# EAGLE design tinytemp3v3-v01 (EAGLE 5.10)
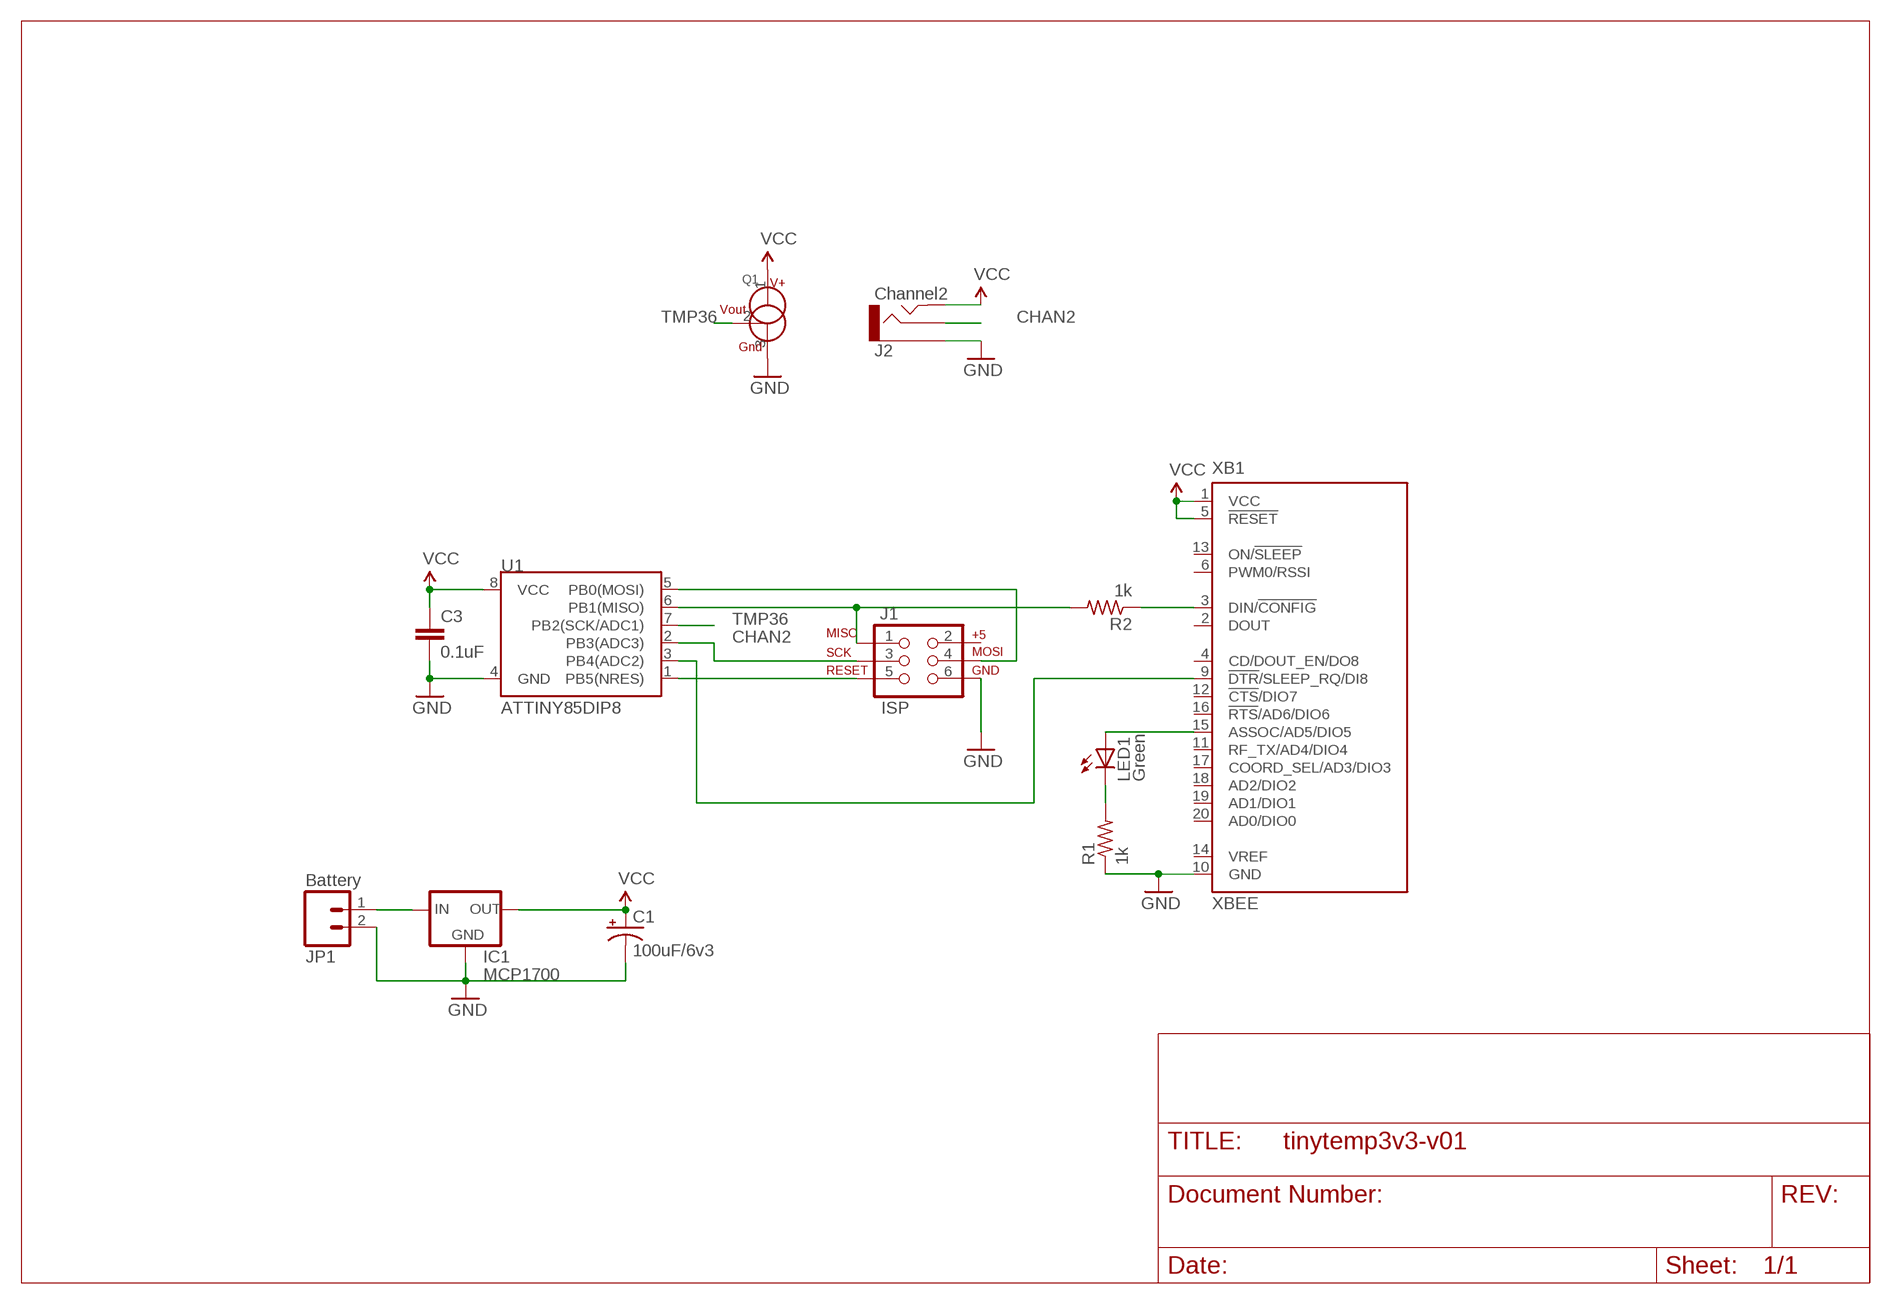
[diagram p0: schematic, sheet 1]

## Parts
C1  100uF/6v3  CPOL-USE2.5-6  [E2,5-6]
C3  0.1uF  C-EU050-024X044  [C050-024X044]
IC1  MCP1700  MCP1700INLINE  [TO92-INLINE]
J1  ISP  AVR_SPI_PRG_62X3_LOCK  [2X3_LOCK]
J2  Channel2  AUDIO-JACK2.5MM  [STEREOJACK2.5MM_STEREOJACK2.5MM]
JP1  Battery  M025MM  [SCREWTERMINAL-5MM-2]
LED1  Green  LED3MM  [LED3MM]
Q1  TMP36  TMP35,TMP36,TMP37  [TO92-INLINE]
R1  1k  R-US_0207/7  [0207/7]
R2  1k  R-US_0207/7  [0207/7]
U1  ATTINY85DIP8  ATTINY45DIP8  [DIP08]
XB1  XBEE  [XBEE]

## Nets
CHAN2: J1.3 J2.TIP U1.2(PB3(ADC3))
GND: C1.- C3.2 IC1.1(GND) J1.6 J2.RING1 JP1.2 Q1.3(GND) R1.1 U1.4(GND) XB1.10(GND)
N$1: IC1.2(IN) JP1.1
N$2: J1.5 U1.1(PB5(NRES))
N$3: J1.4 U1.5(PB0(MOSI))
N$4: J1.1 R2.2 U1.6(PB1(MISO))
N$5: R2.1 XB1.3(DIN/!CONFIG)
N$6: U1.3(PB4(ADC2)) XB1.9(!DTR!/SLEEP_RQ/DI8)
N$7: LED1.A XB1.15(ASSOC/AD5/DIO5)
N$8: LED1.K(C) R1.2
TMP36: Q1.2(VOUT) U1.7(PB2(SCK/ADC1))
VCC: C1.+ C3.1 IC1.3(OUT) J2.SHIELD Q1.1(V+) U1.8(VCC) XB1.1(VCC) XB1.5(!RESET)
Unconnected: J1.2 XB1.2(DOUT) XB1.4(CD/DOUT_EN/DO8) XB1.6(PWM0/RSSI) XB1.11(RF_TX/AD4/DIO4) XB1.12(!CTS!/DIO7) XB1.13(ON/!SLEEP) XB1.14(VREF) XB1.16(!RTS!/AD6/DIO6) XB1.17(COORD_SEL/AD3/DIO3) XB1.18(AD2/DIO2) XB1.19(AD1/DIO1) XB1.20(AD0/DIO0)

## Library data of the parts
C1 = resistor:CPOL-US: POLARIZED CAPACITOR, American symbol
C3 = resistor:C-EU: CAPACITOR, European symbol
IC1 = adafruit:MCP1700: VOLTAGE REGULATOR
J1 = karlnet-parts:AVR_SPI_PRG_6: AVR ISP 6 Pin This is the reduced ISP connector for AVR programming. Common on Arduino. This footprint will take up less PCB space and can be used with a 10-pin to 6-pin adapter such as SKU: BOB-08508
J2 = SparkFun:AUDIO-JACK: 3.5mm Audio Jack Simple 3.5mm common PCB mount audio jack. SKU: PRT-08032
JP1 = SparkFun:M02: Header 2 Standard 2-pin 0.1" header. Use with straight break away headers (SKU : PRT-00116), right angle break away headers (PRT-00553), swiss pins (PRT-00743), machine pins (PRT-00117), and female headers (PRT-00115). Molex polarized connector foot print use with SKU : PRT-08233 with associated crimp pins and housings.
LED1 = adafruit:LED: LED OSRAM: - CHIPLED LG R971, LG N971, LY N971, LG Q971, LY Q971, LO R971, LY R971 LH N974, LH R974 LS Q976, LO Q976, LY Q976 LO Q996 - Hyper CHIPLED LW Q18S LB Q993, LB Q99A, LB R99A - SideLED LS A670, LO A670, LY A670, LG A670, LP A670 LB A673, LV A673, LT A673, LW A673 LH A674 LY A675 LS A676, LA A676, LO A676, LY A676, LW A676 LS A679, LY A679, LG A679 - Hyper Micro SIDELED® LS Y876, LA Y876, LO Y876, LY Y876 LT Y87S - SmartLED LW L88C, LW L88S LB L89C, LB L89S, LG L890 LS L89K, LO L89K, LY L89K LS L896, LA L896, LO L896, LY L896 - TOPLED LS T670, LO T670, LY T670, LG T670, LP T670 LSG T670, LSP T670, LSY T670, LOP T670, LYG T670 LG T671, LOG T671, LSG T671 LB T673, LV T673, LT T673, LW T673 LH T674 LS T676, LA T676, LO T676, LY T676, LB T676, LH T676, LSB T676, LW T676 LB T67C, LV T67C, LT T67C, LS T67K, LO T67K, LY T67K, LW E67C LS E67B, LA E67B, LO E67B, LY E67B, LB E67C, LV E67C, LT E67C LW T67C LS T679, LY T679, LG T679 LS T770, LO T770, LY T770, LG T770, LP T770 LB T773, LV T773, LT T773, LW T773 LH T774 LS E675, LA E675, LY E675, LS T675 LS T776, LA T776, LO T776, LY T776, LB T776 LHGB T686 LT T68C, LB T68C - Hyper Mini TOPLED® LB M676 - Mini TOPLED Santana® LG M470 LS M47K, LO M47K, LY M47K Source: http://www.osram.convergy.de/
Q1 = karlnet-parts:TMP35,TMP36,TMP37: Analog Devices TMP35, TMP36 and TMP37 analog output temperature sensors, TO-92 packaging
R1 R2 = resistor:R-US_: RESISTOR, American symbol
U1 = SparkFun:ATTINY45: Atmel ATTiny45
XB1 = microbuilder:XBEE: XBee (TM) /XBee-PRO(TM) OEM RF Modules Source: MaxStream, Inc. xbee_productmanual.pdf

## Board
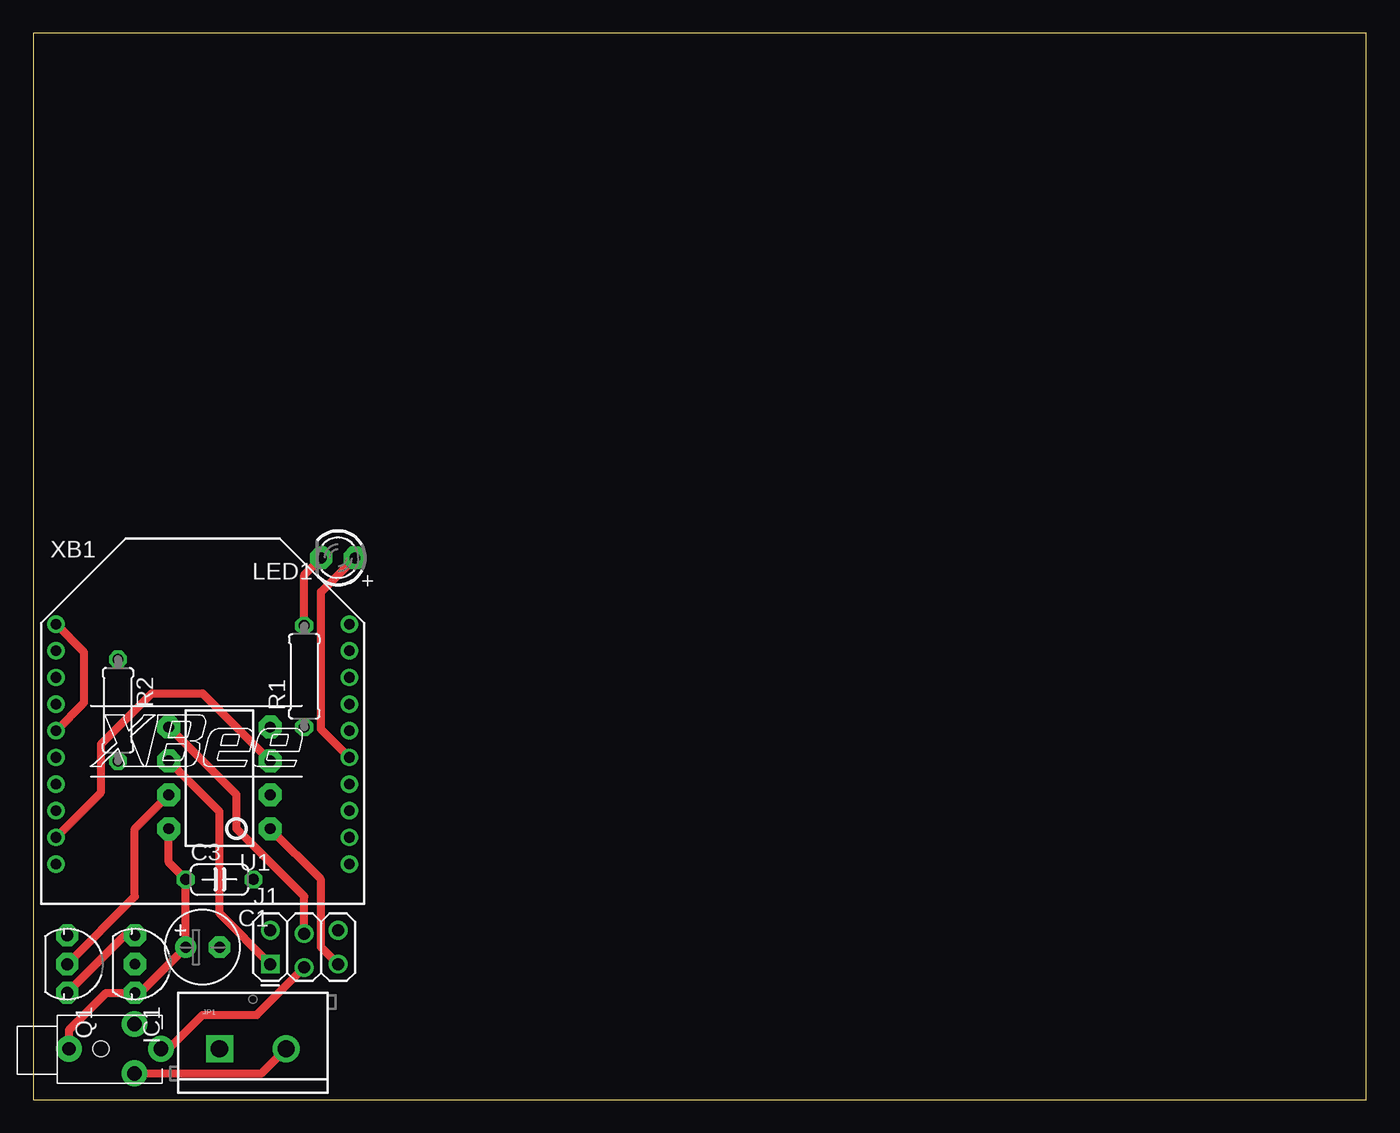
[diagram p1: board, top side]
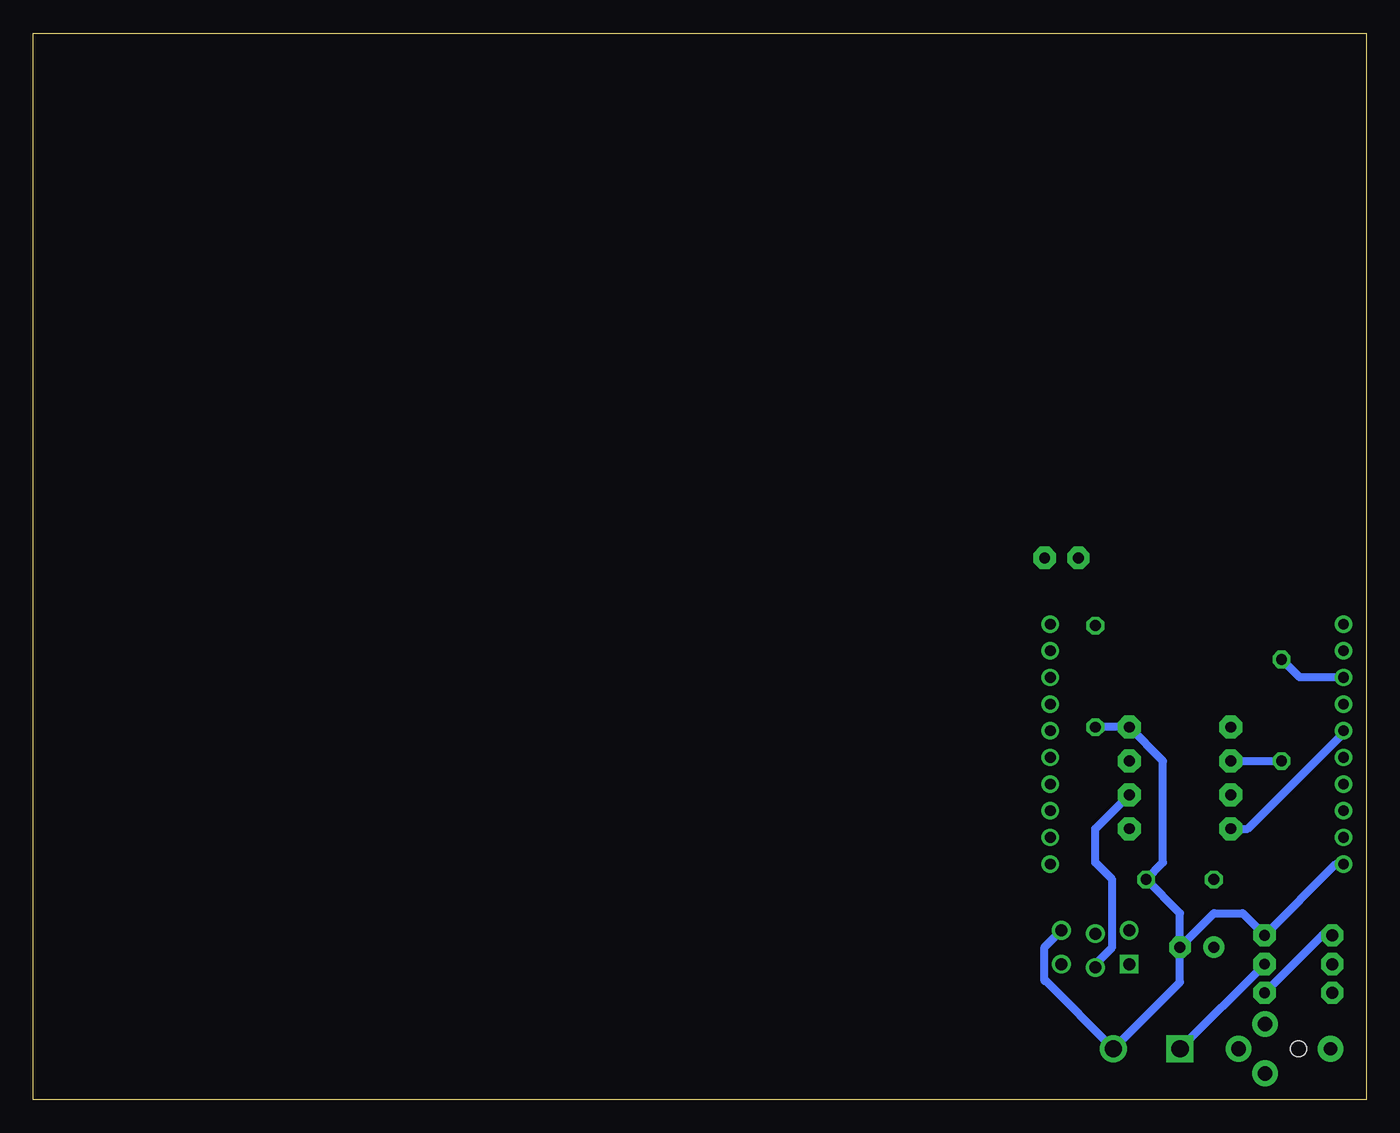
[diagram p2: board, bottom side, seen from below]

Size 100 x 80 mm. Coordinates in mm from the lower left corner, seen from the top.
Outline: 0,0 100,0 100,80 0,80 0,0
Copper layers (1*16): Top 0.035mm / dielectric 1.5mm / Bottom 0.035mm
Design rules "olimex-10mils": minimum track width 10mil, minimum drill 24mil, track to track 10mil, track to pad 10mil, pad to pad 10mil, via to via 10mil, smd to smd 10mil, copper to edge 40mil, drill to drill 10mil, minimum pad ring 10mil, minimum via ring 8mil, stop-mask expansion 0mil, vias tented up to drill 0mil, thermal gap 10mil

### Footprints (pad centres in the part's own frame; a part is rotated, then mirrored left to right if it is on the bottom)
E2,5-6 = drill 0.813 pad 1.6 round: + -1.27,0 | drill 0.813 pad 1.6 octagon: - 1.27,0
C050-024X044 = drill 0.813 octagon: 1 -2.54,0; 2 2.54,0
TO92-INLINE = drill 0.813 pad 1.676 octagon: 1 -2.159,0; 2 0,0; 3 2.159,0
2X3_LOCK = drill 0.9 square: 1 0,0 | drill 0.9 round: 2 0,2.54; 3 2.54,-0.254; 4 2.54,2.286; 5 5.08,0; 6 5.08,2.54
STEREOJACK2.5MM_STEREOJACK2.5MM = drill 1.1 pad 1.93 round: RING1 2.5,-1.85; RING2 2.5,1.85; TIP 4.5,0 | drill 1 pad 1.93 round: SHIELD -2.4,0 | hole 1.2: 0,0
SCREWTERMINAL-5MM-2 = drill 1.3 pad 2.032 square: 1 0,0 | drill 1.3 pad 2.032 round: 2 5,0
LED3MM = drill 0.813 pad 1.676 octagon: A -1.27,0; K 1.27,0
TO92-INLINE' = drill 0.9 pad 1.676 octagon: 1 -2.159,0; 2 0,0; 3 2.159,0
0207/7 = drill 0.813 octagon: 1 -3.81,0; 2 3.81,0
DIP08 = drill 0.813 pad 1.727 octagon: 1 -3.81,-3.81; 2 -1.27,-3.81; 3 1.27,-3.81; 4 3.81,-3.81; 5 3.81,3.81; 6 1.27,3.81; 7 -1.27,3.81; 8 -3.81,3.81
XBEE = drill 0.8 pad 1.27 round: 1 -11,9; 2 -11,7; 3 -11,5; 4 -11,3; 5 -11,1; 6 -11,-1; 7 -11,-3; 8 -11,-5; 9 -11,-7; 10 -11,-9; 11 11,-9; 12 11,-7; 13 11,-5; 14 11,-3; 15 11,-1; 16 11,1; 17 11,3; 18 11,5; 19 11,7; 20 11,9

### Placement (x,y rotation side)
C1  12.7,11.43 0 top
C3  13.97,16.51 0 top
IC1  7.62,10.16 270 top
J1  17.78,10.16 0 top
J2  5.08,3.81 0 top
JP1  13.97,3.81 0 top
LED1  22.86,40.64 180 top
Q1  TMP36  [TO92-INLINE']  2.54,10.16 270 top
R1  20.32,31.75 90 top
R2  6.35,29.21 270 top
U1  13.97,24.13 90 top
XB1  12.7,26.67 0 top

### Tracks (layer width: path | path; a pad name or v marks a point on that pad's centre or on a via)
CHAN2
  Top 0.61: J2.TIP 10.16,3.81 12.7,6.35 16.76,6.35 J1.3
  Bottom 0.305: J1.3 20.32,10.16
  Bottom 0.61: 20.32,10.16 19.05,11.43 19.05,16.51 20.32,17.78 20.32,20.32 U1.2
GND
  Top 0.61: JP1.2 17.12,1.96 J2.RING1 | Q1.3 6.86,12.32 IC1.1
  Bottom 0.61: C1.- 13.97,13.97 C3.2 15.24,17.78 15.24,25.4 U1.4 R1.1 | C1.- 13.97,8.81 JP1.2 24.05,8.89 24.13,8.89 24.13,11.43 J1.6 | XB1.10 2.27,17.67 IC1.1 9.27,13.97 11.43,13.97 C1.-
N$1
  Bottom 0.61: JP1.1 IC1.2
N$2
  Top 0.61: J1.5 21.59,11.43 21.59,16.51 U1.1
N$3
  Top 0.61: J1.4 20.32,15.24 15.24,20.32 15.24,22.86 U1.5
N$4
  Top 0.61: J1.1 13.97,13.97 13.97,21.59 U1.6
  Bottom 0.61: U1.6 R2.2
N$5
  Bottom 0.61: R2.1 5,31.67 XB1.3
N$6
  Top 0.61: XB1.9 5.08,23.05 5.08,26.67 8.89,30.48 12.7,30.48 U1.3
N$7
  Top 0.61: LED1.A 21.59,38.1 21.59,27.78 XB1.15
N$8
  Top 0.61: R1.2 20.32,39.37 LED1.K
TMP36
  Top 0.61: Q1.2 7.62,15.24 7.62,20.32 U1.7
VCC
  Top 0.61: U1.8 10.16,17.78 C3.1 C1.+ 8,8 IC1.3 5.46,8 2.68,5.22 J2.SHIELD | XB1.1 3.81,33.56 3.81,29.78 XB1.5
  Bottom 0.61: IC1.3 3.3,12.32 Q1.1 | XB1.5 1.7,27.51 8.89,20.32 U1.8